# EAGLE design MeterMaid (EAGLE 9.5.2)
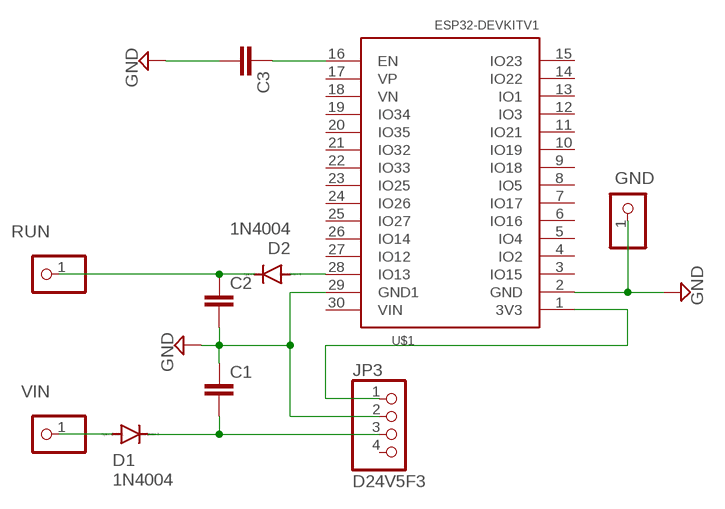
[diagram p0: schematic, sheet 1]

## Parts
C1  C-EU025-050X050  [C025-050X050]
C2  C-EU025-050X050  [C025-050X050]
C3  C-EU025-050X050  [C025-050X050]
D1  1N4004  [DO41-10]
D2  1N4004  [DO41-10]
GND  PINHD-1X1  [1X01]
JP3  D24V5F3  PINHD-1X4  [1X04]
RUN  PINHD-1X1  [1X01]
U$1  ESP32DEVKITV1  [ESP32-DEVKITV1]
VIN  PINHD-1X1  [1X01]

## Nets
GND: C1.1 C2.2 C3.2 GND.1 JP3.2 U$1.2(GND) U$1.29(GND1)
N$1: JP3.1 U$1.1(3V3)
N$2: C1.2 D1.C JP3.3
N$3: D2.A U$1.28(IO13)
N$4: C2.1 D2.C RUN.1
N$5: C3.1 U$1.16(EN)
VIN: D1.A VIN.1
Unconnected: JP3.4 U$1.3(IO15) U$1.4(IO2) U$1.5(IO4) U$1.6(IO16) U$1.7(IO17) U$1.8(IO5) U$1.9(IO18) U$1.10(IO19) U$1.11(IO21) U$1.12(IO3) U$1.13(IO1) U$1.14(IO22) U$1.15(IO23) U$1.17(VP) U$1.18(VN) U$1.19(IO34) U$1.20(IO35) U$1.21(IO32) U$1.22(IO33) U$1.23(IO25) U$1.24(IO26) U$1.25(IO27) U$1.26(IO14) U$1.27(IO12) U$1.30(VIN)

## Library data of the parts
C1-C3 = rcl:C-EU: CAPACITOR, European symbol; SPICEPREFIX: C
D1 D2 = diode:1N4004: DIODE general purpose rectifier, 1 A
GND RUN VIN = pinhead:PINHD-1X1: PIN HEADER
JP3 = pinhead:PINHD-1X4: PIN HEADER
U$1 = ESP32-DEVKITV1MOD:ESP32DEVKITV1

## Board
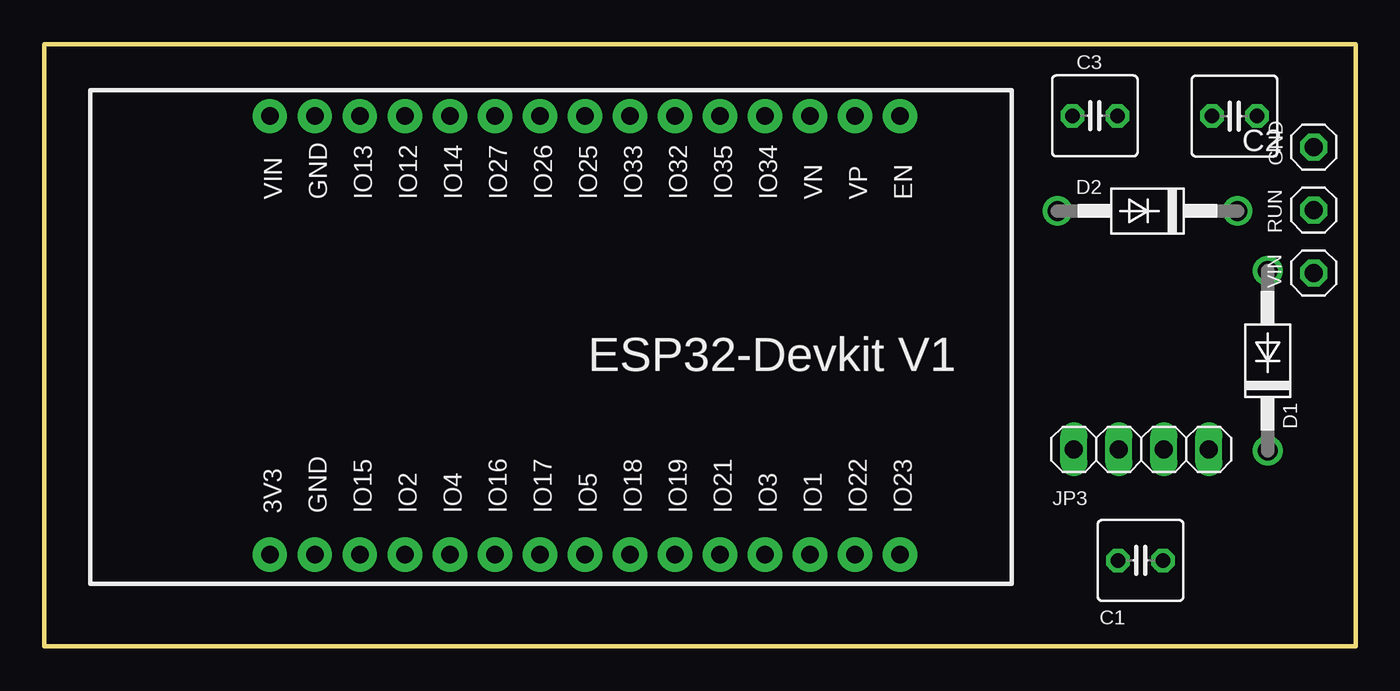
[diagram p1: board, top side]
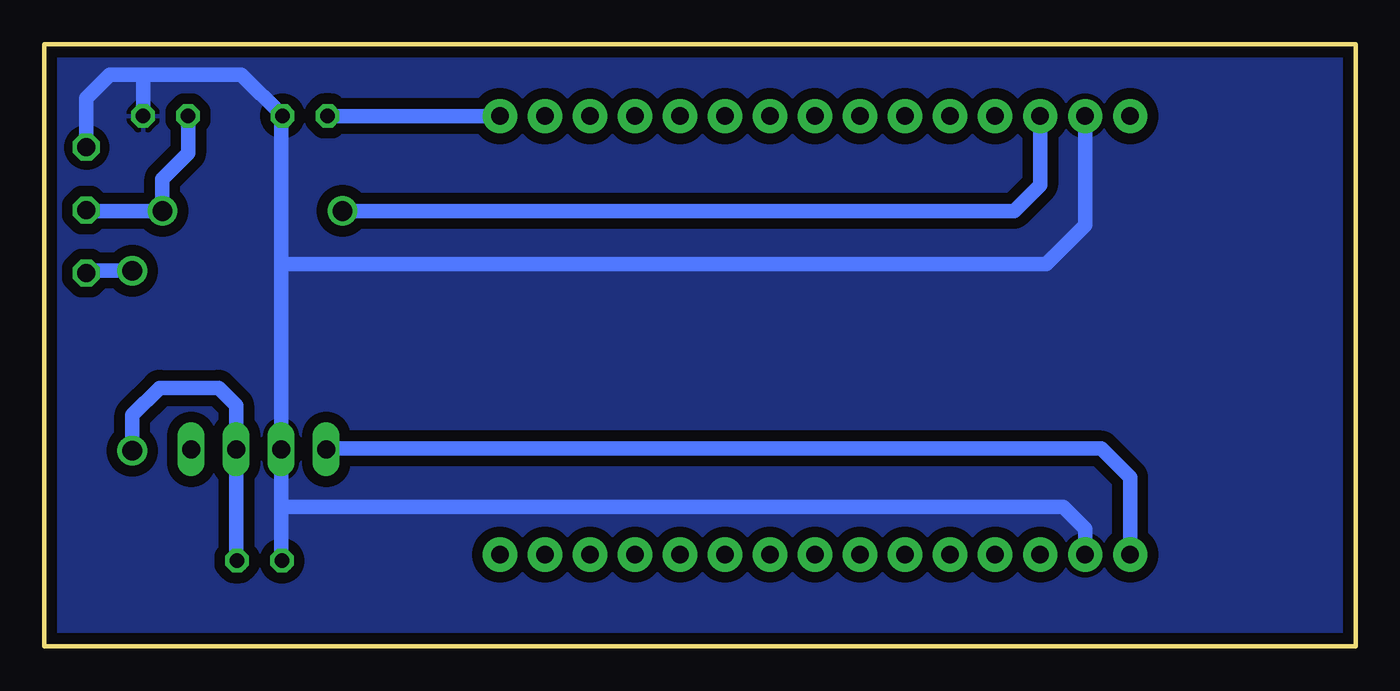
[diagram p2: board, bottom side, seen from below]

Size 74 x 34 mm. Coordinates in mm from the lower left corner, seen from the top.
Outline: 0,0 74,0 74,34 0,34 0,0
Copper layers (1*16): Top 0.035mm / dielectric 1.5mm / Bottom 0.035mm
Design rules "default *": minimum track width 6mil, minimum drill 0.35mm, track to track 6mil, track to pad 6mil, pad to pad 6mil, via to via 6mil, smd to smd 6mil, copper to edge 10mil, drill to drill 6mil, minimum pad ring 10mil, minimum via ring 8mil, stop-mask expansion 4mil, vias tented up to drill 0mil, thermal gap 10mil

### Footprints (pad centres in the part's own frame; a part is rotated, then mirrored left to right if it is on the bottom)
C025-050X050 = drill 0.813 octagon: 1 -1.27,0; 2 1.27,0
DO41-10 = drill 1.118: A 5.08,0; C -5.08,0
1X01 = drill 1.016 octagon: 1 0,0
1X04 = drill 1.016 long: 1 -3.81,0; 2 -1.27,0; 3 1.27,0; 4 3.81,0
ESP32-DEVKITV1 = drill 1 pad 1.93: 1 -22.87,-13.54; 2 -20.33,-13.54; 3 -17.79,-13.54; 4 -15.25,-13.54; 5 -12.71,-13.54; 6 -10.17,-13.54; 7 -7.63,-13.54; 8 -5.09,-13.54; 9 -2.55,-13.54; 10 -0.01,-13.54; 11 2.53,-13.54; 12 5.07,-13.54; 13 7.61,-13.54; 14 10.15,-13.54; 15 12.69,-13.54; 16 12.69,11.23; 17 10.15,11.23; 18 7.61,11.23; 19 5.07,11.23; 20 2.53,11.23; 21 -0.01,11.23; 22 -2.55,11.23; 23 -5.09,11.23; 24 -7.63,11.23; 25 -10.17,11.23; 26 -12.71,11.23; 27 -15.25,11.23; 28 -17.79,11.23; 29 -20.33,11.23; 30 -22.87,11.23

### Placement (x,y rotation side)
C1  61.86,4.85 0 top
C2  67.16,29.95 0 top
C3  59.28,29.96 0 top
D1  69.04,16.13 90 top
D2  62.25,24.59 180 top
GND  71.63,28.19 0 top
JP3  61.91,11.12 0 top
RUN  71.63,24.64 0 top
U$1  35.6,18.72 0 top
VIN  71.63,21.08 0 top

### Tracks (layer width: path | path; a pad name or v marks a point on that pad's centre or on a via)
GND
  Bottom 0.152: C3.2 60.64,29.87
  Bottom 0.813: 60.64,7.87 60.64,4.9 C1.1 | U$1.2 15.27,6.63 16.51,7.87 60.64,7.87 | U$1.29 15.27,23.8 17.48,21.59 60.64,21.59 | 60.64,29.87 60.64,21.59 | 60.64,7.87 JP3.2 60.64,21.59 | C3.2 62.88,32.28 68.43,32.28 | 68.43,32.28 70.31,32.28 71.63,30.96 GND.1 | C2.2 68.43,32.28
  pour Bottom (isolate 0.61): 0.03,33.99 73.99,33.99 73.99,0.03 0.03,0.03
N$1
  Bottom 0.813: U$1.1 12.73,9.55 14.35,11.18 58.04,11.18 JP3.1
N$2
  Bottom 0.813: C1.2 63.18,4.9 JP3.3 63.17,13.61 64.16,14.61 67.49,14.61 69.04,13.06 D1.C
N$3
  Bottom 0.813: U$1.28 17.81,26.06 19.28,24.59 D2.A
N$4
  Bottom 0.813: RUN.1 71.58,24.59 D2.C 67.33,26.39 65.89,27.84 C2.1
N$5
  Bottom 0.813: U$1.16 58,29.95 C3.1
N$6  (via drill 0.35 pad 1.3)
  other vias: 71.63,24.64
N$7  (via drill 0.35 pad 1.3)
  other vias: 58.01,29.97
N$8  (via drill 0.35 pad 1.3)
  other vias: 60.55,29.95
N$10  (via drill 0.35 pad 1.3)
  other vias: 71.6,28.17
N$11  (via drill 0.35 pad 1.3)
  other vias: 69.04,21.18
N$12  (via drill 0.35 pad 1.3)
  other vias: 57.18,24.56
N$13  (via drill 0.35 pad 1.3)
  other vias: 67.31,24.56
N$14  (via drill 0.35 pad 1.3)
  other vias: 71.65,24.64
N$15  (via drill 0.35 pad 1.3)
  other vias: 71.65,21.08
N$16  (via drill 0.35 pad 1.3)
  other vias: 69.04,11.02
N$17  (via drill 0.35 pad 1.3)
  other vias: 12.73,29.92
N$18  (via drill 0.35 pad 1.3)
  other vias: 45.75,29.92
N$19  (via drill 0.35 pad 1.3)
  other vias: 43.21,29.95
N$20  (via drill 0.35 pad 1.3)
  other vias: 40.67,29.95
N$21  (via drill 0.35 pad 1.3)
  other vias: 38.13,29.95
N$22  (via drill 0.35 pad 1.3)
  other vias: 35.59,29.95
N$23  (via drill 0.35 pad 1.3)
  other vias: 33.05,29.95
N$24  (via drill 0.35 pad 1.3)
  other vias: 30.51,29.95
N$25  (via drill 0.35 pad 1.3)
  other vias: 27.97,29.95
N$26  (via drill 0.35 pad 1.3)
  other vias: 25.43,29.95
N$27  (via drill 0.35 pad 1.3)
  other vias: 22.89,29.95
N$28  (via drill 0.35 pad 1.3)
  other vias: 20.37,29.92
N$29  (via drill 0.35 pad 1.3)
  other vias: 17.81,29.92
N$30  (via drill 0.35 pad 1.3)
  other vias: 15.27,29.95
N$31  (via drill 0.35 pad 1.3)
  other vias: 12.73,5.13
N$32  (via drill 0.35 pad 1.3)
  other vias: 15.27,5.16
N$33  (via drill 0.35 pad 1.3)
  other vias: 17.83,5.18
N$34  (via drill 0.35 pad 1.3)
  other vias: 20.35,5.18
N$35  (via drill 0.35 pad 1.3)
  other vias: 22.91,5.18
N$36  (via drill 0.35 pad 1.3)
  other vias: 25.43,5.18
N$37  (via drill 0.35 pad 1.3)
  other vias: 27.99,5.18
N$38  (via drill 0.35 pad 1.3)
  other vias: 30.53,5.18
N$39  (via drill 0.35 pad 1.3)
  other vias: 33.05,5.18
N$40  (via drill 0.35 pad 1.3)
  other vias: 35.61,5.21
N$41  (via drill 0.35 pad 1.3)
  other vias: 38.1,5.18
N$42  (via drill 0.35 pad 1.3)
  other vias: 40.69,5.18
N$43  (via drill 0.35 pad 1.3)
  other vias: 43.21,5.18
N$44  (via drill 0.35 pad 1.3)
  other vias: 45.75,5.18
N$45  (via drill 0.35 pad 1.3)
  other vias: 48.29,5.18
N$46  (via drill 0.35 pad 1.3)
  other vias: 48.29,29.92
N$47  (via drill 0.35 pad 1.3)
  other vias: 60.58,4.83
N$48  (via drill 0.35 pad 1.3)
  other vias: 58.09,11.18
N$49  (via drill 0.35 pad 1.3)
  other vias: 60.63,11.15
N$50  (via drill 0.35 pad 1.3)
  other vias: 63.14,11.07
N$51  (via drill 0.35 pad 1.3)
  other vias: 65.74,11.07
N$52  (via drill 0.35 pad 1.3)
  other vias: 63.12,4.83
VIN
  Bottom 0.813: D1.A 71.5,21.21 VIN.1